# EAGLE design main (EAGLE 9.6.2)

## Sheet 1 of 4
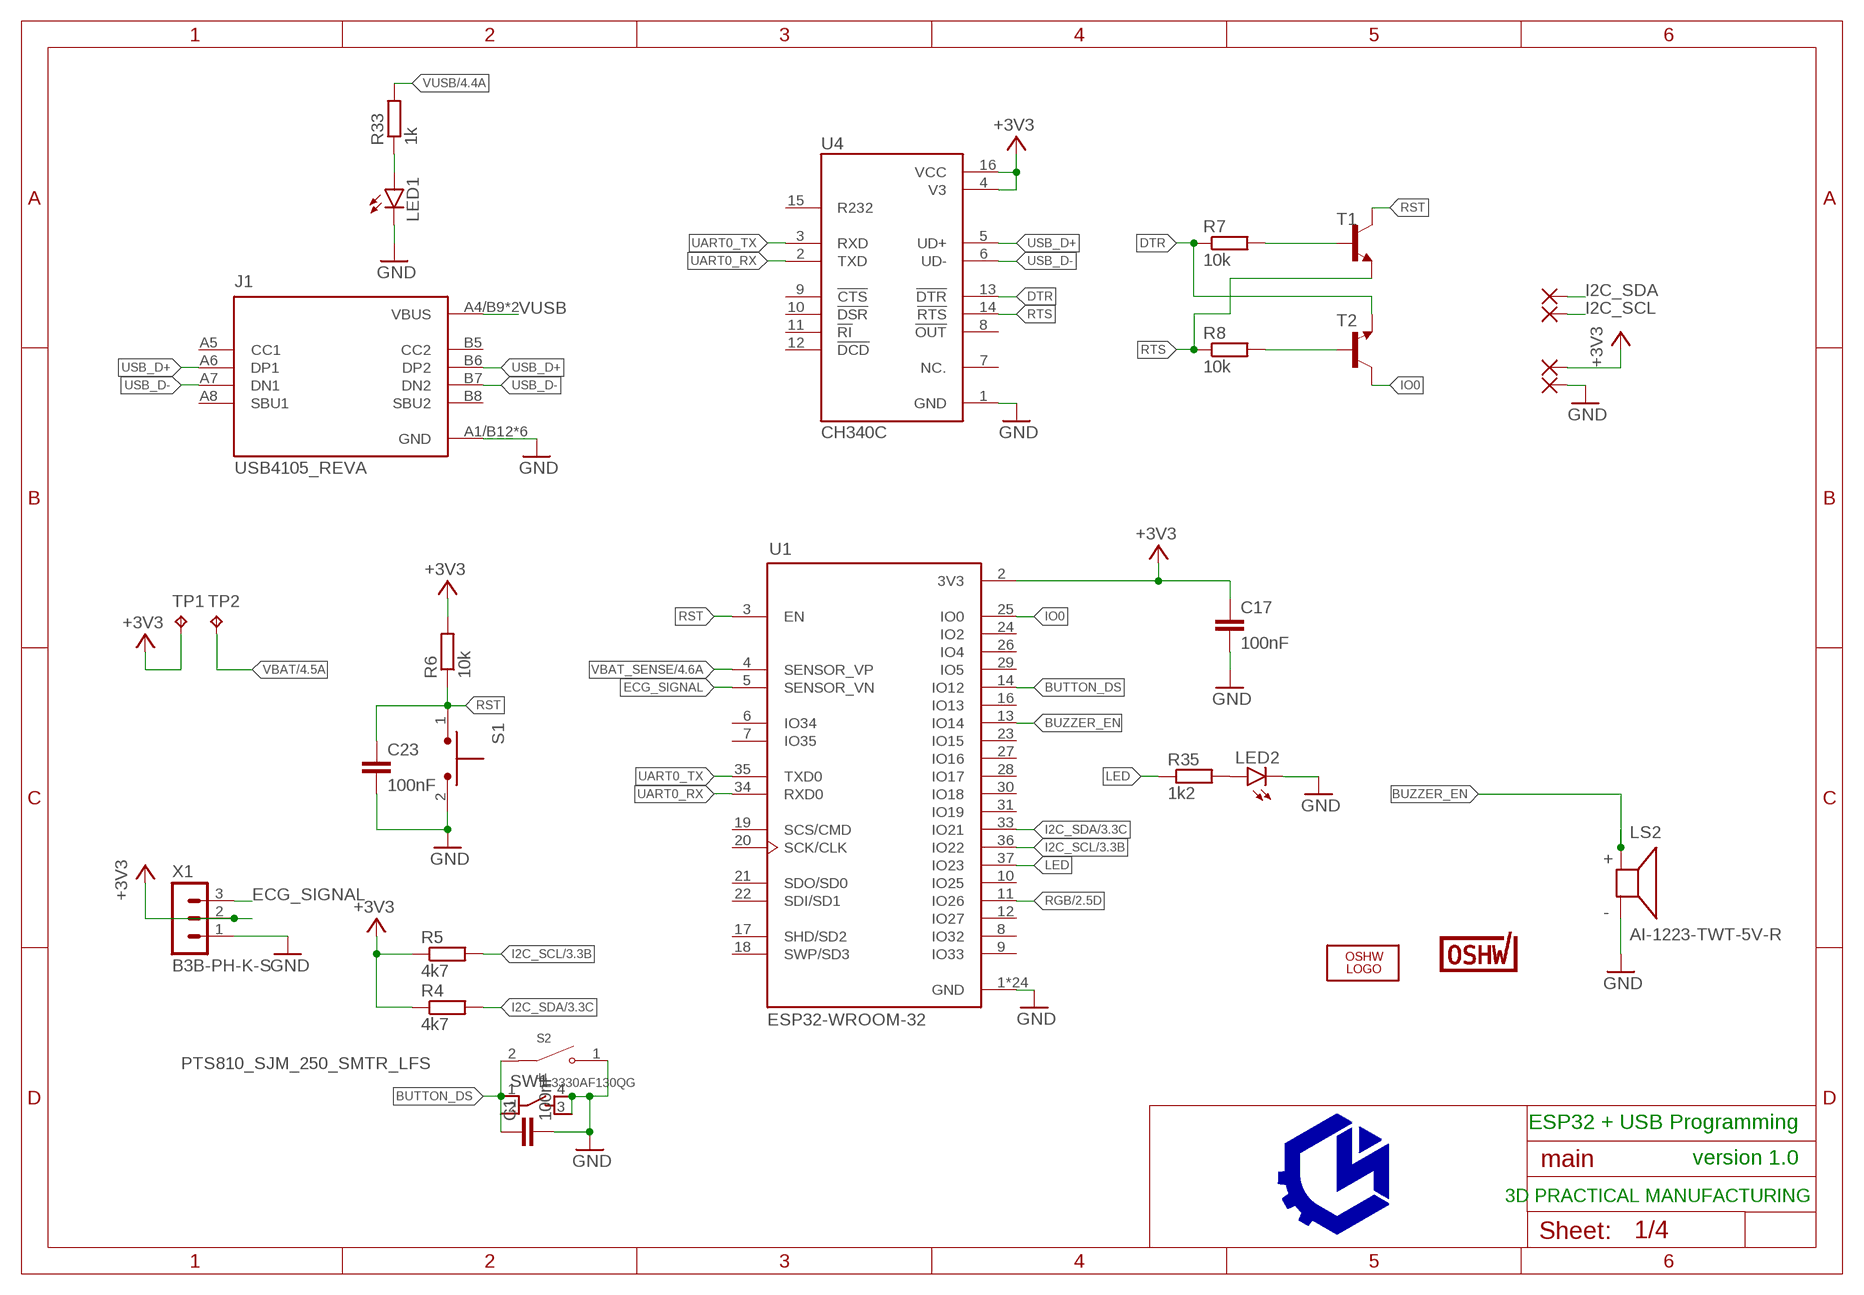
[diagram p0: schematic, sheet 1]

### Parts
C1  100nF  C-EUC0603  [C0603]
C17  100nF  C-EUC0603  [C0603]
C23  100nF  C-EUC0603  [C0603]
J1  USB4105_REVA  [GCT_USB4105_REVA]
LED1  LEDCHIP-LED0603  [CHIP-LED0603]
LED2  LEDCHIP-LED0603  [CHIP-LED0603]
LOGO2  OSHW_LOGO_FILLX0200-NT  [OSHW_FILLX200_NOTEXT]
LS2  AI-1223-TWT-5V-R  [XDCR_AI-1223-TWT-5V-R]
PAD1  WIREPADSMD1,27-254  [SMD1,27-2,54]
PAD2  WIREPADSMD1,27-254  [SMD1,27-2,54]
PAD3  WIREPADSMD1,27-254  [SMD1,27-2,54]
PAD4  WIREPADSMD1,27-254  [SMD1,27-2,54]
R4  4k7  R-EU_R0603  [R0603]
R5  4k7  R-EU_R0603  [R0603]
R6  10k  R-EU_R0603  [R0603]
R7  10k  R-EU_R0603  [R0603]
R8  10k  R-EU_R0603  [R0603]
R33  1k  R-EU_R0603  [R0603]
R35  1k2  R-EU_R0603  [R0603]
S1  TL1015AF160QG  [SW_TL1015AF160QG]
S2  TL3330AF130QG  [SW_TL3330AF130QG]
SW1  PTS810_SJM_250_SMTR_LFS  [SW_PTS810_SJM_250_SMTR_LFS]
T1  MMBT4401LT1-NPN-SOT23-BEC  [SOT23-BEC]
T2  MMBT4401LT1-NPN-SOT23-BEC  [SOT23-BEC]
TP1  TPB1,27  [B1,27]
TP2  TPB1,27  [B1,27]
U1  ESP32-WROOM-32  [MODULE_ESP32-WROOM-32]
U4  CH340C  [SOIC127P600X180-16N]
U$10  CERT-SMALL  [CERT-SMALL-SILK]
X1  B3B-PH-K-S  [B3B-PH-K-S]

### Nets
+3V3: C17.1 PAD4.1(P) R4.1 R5.1 R6.2 TP1.TP U1.2(3V3) U4.4(V3) U4.16(VCC) X1.2 ; also sheet 2,3,4
BUTTON_DS: C1.1 S2.2 SW1.1 SW1.2 U1.14(IO12)
BUZZER_EN: LS2.P(+) U1.13(IO14)
DTR: R7.1 T2.E U4.13(!DTR)
ECG_SIGNAL: U1.5(SENSOR_VN) X1.3
GND: C1.2 C17.2 C23.2 J1.A1/B12(GND) J1.B1/A12(GND) J1.G1(GND) J1.G2(GND) J1.G3(GND) J1.G4(GND) LED1.C LED2.C LS2.N(-) PAD2.1(P) S1.2 S2.1 SW1.3 SW1.4 U1.1(GND) U1.15(GND) U1.38(GND) U1.39_1(GND) U1.39_2(GND) U1.39_3(GND) U1.39_4(GND) U1.39_5(GND) U1.39_6(GND) U1.39_7(GND) U1.39_8(GND) U1.39_9(GND) U1.39_10(GND) U1.39_11(GND) U1.39_12(GND) U1.39_13(GND) U1.39_14(GND) U1.39_15(GND) U1.39_16(GND) U1.39_17(GND) U1.39_18(GND) U1.39_19(GND) U1.39_20(GND) U1.39_21(GND) U4.1(GND) X1.1 ; also sheet 2,3,4
I2C_SCL: PAD3.1(P) R5.2 U1.36(IO22) ; also sheet 3
I2C_SDA: PAD1.1(P) R4.2 U1.33(IO21) ; also sheet 3
IO0: T2.C U1.25(IO0)
LED: R35.1 U1.37(IO23)
N$1: R7.2 T1.B
N$2: R8.2 T2.B
N$10: LED1.A R33.1
N$22: LED2.A R35.2
RGB: U1.11(IO26) ; also sheet 2
RST: C23.1 R6.1 S1.1 T1.C U1.3(EN)
RTS: R8.1 T1.E U4.14(!RTS)
UART0_RX: U1.34(RXD0) U4.2(TXD)
UART0_TX: U1.35(TXD0) U4.3(RXD)
USB_D+: J1.A6(DP1) J1.B6(DP2) U4.5(UD+)
USB_D-: J1.A7(DN1) J1.B7(DN2) U4.6(UD-)
VBAT: TP2.TP ; also sheet 4
VBAT_SENSE: U1.4(SENSOR_VP) ; also sheet 4
VUSB: J1.A4/B9(VBUS) J1.B4/A9(VBUS) R33.2 ; also sheet 4
Unconnected: J1.A5(CC1) J1.A8(SBU1) J1.B5(CC2) J1.B8(SBU2) U1.6(IO34) U1.7(IO35) U1.8(IO32) U1.9(IO33) U1.10(IO25) U1.12(IO27) U1.16(IO13) U1.17(SHD/SD2) U1.18(SWP/SD3) U1.19(SCS/CMD) U1.20(SCK/CLK) U1.21(SDO/SD0) U1.22(SDI/SD1) U1.23(IO15) U1.24(IO2) U1.26(IO4) U1.27(IO16) U1.28(IO17) U1.29(IO5) U1.30(IO18) U1.31(IO19) U4.7(NC.) U4.8(!OUT) U4.9(!CTS) U4.10(!DSR) U4.11(!RI) U4.12(!DCD) U4.15(R232)

### Notes on the sheet
- ESP32 + USB Programming
- version 1.0
- 3D PRACTICAL MANUFACTURING

## Sheet 2 of 4
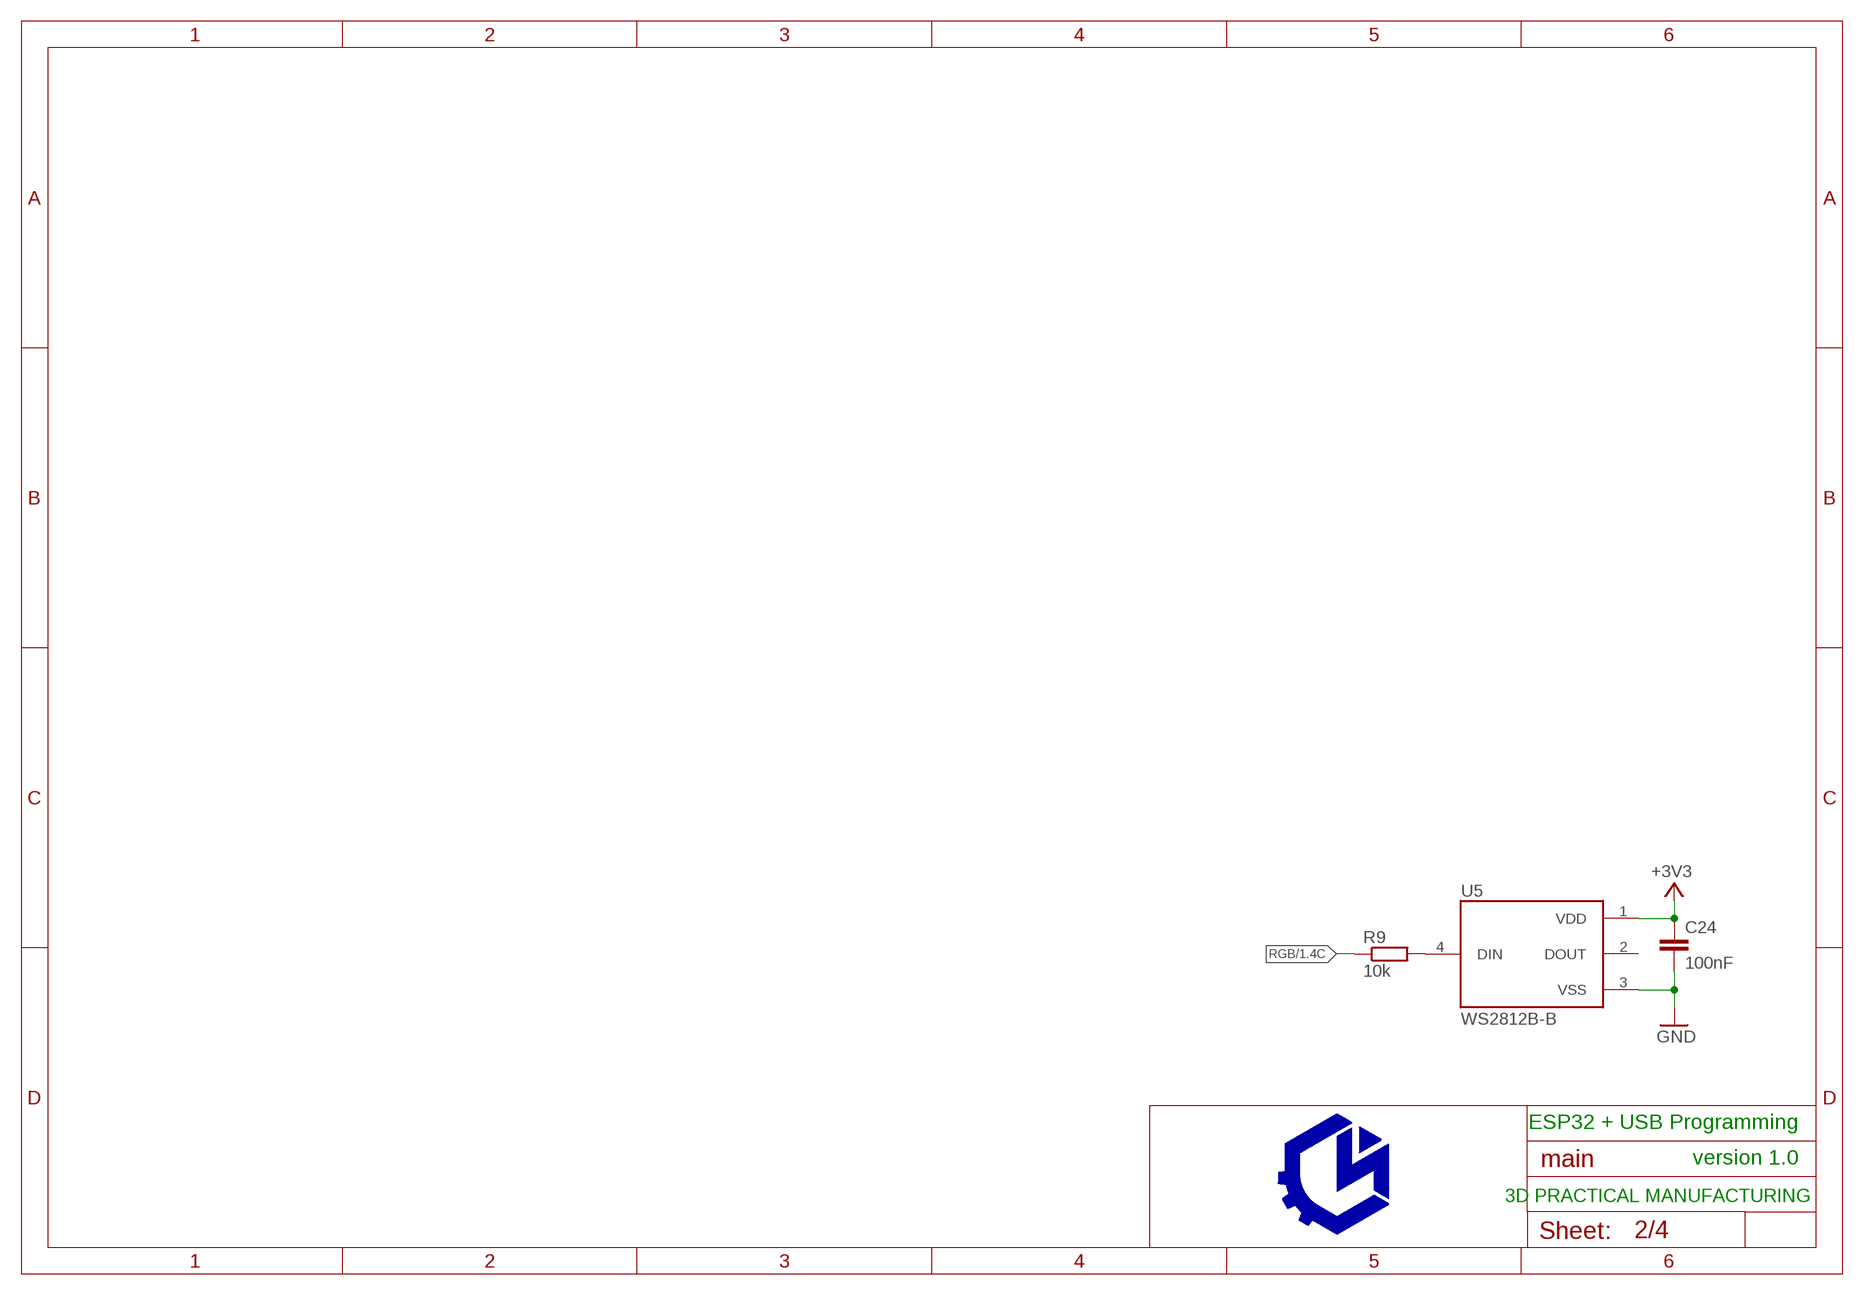
[diagram p1: schematic, sheet 2]

### Parts
C24  100nF  C-EUC0603  [C0603]
R9  10k  R-EU_R0603  [R0603]
U5  WS2812B-B  [LED_WS2812B-B]

### Nets
+3V3: C24.1 U5.1(VDD) ; also sheet 1,3,4
GND: C24.2 U5.3(VSS) ; also sheet 1,3,4
N$3: R9.2 U5.4(DIN)
RGB: R9.1 ; also sheet 1
Unconnected: U5.2(DOUT)

### Notes on the sheet
- ESP32 + USB Programming
- version 1.0
- 3D PRACTICAL MANUFACTURING

## Sheet 3 of 4
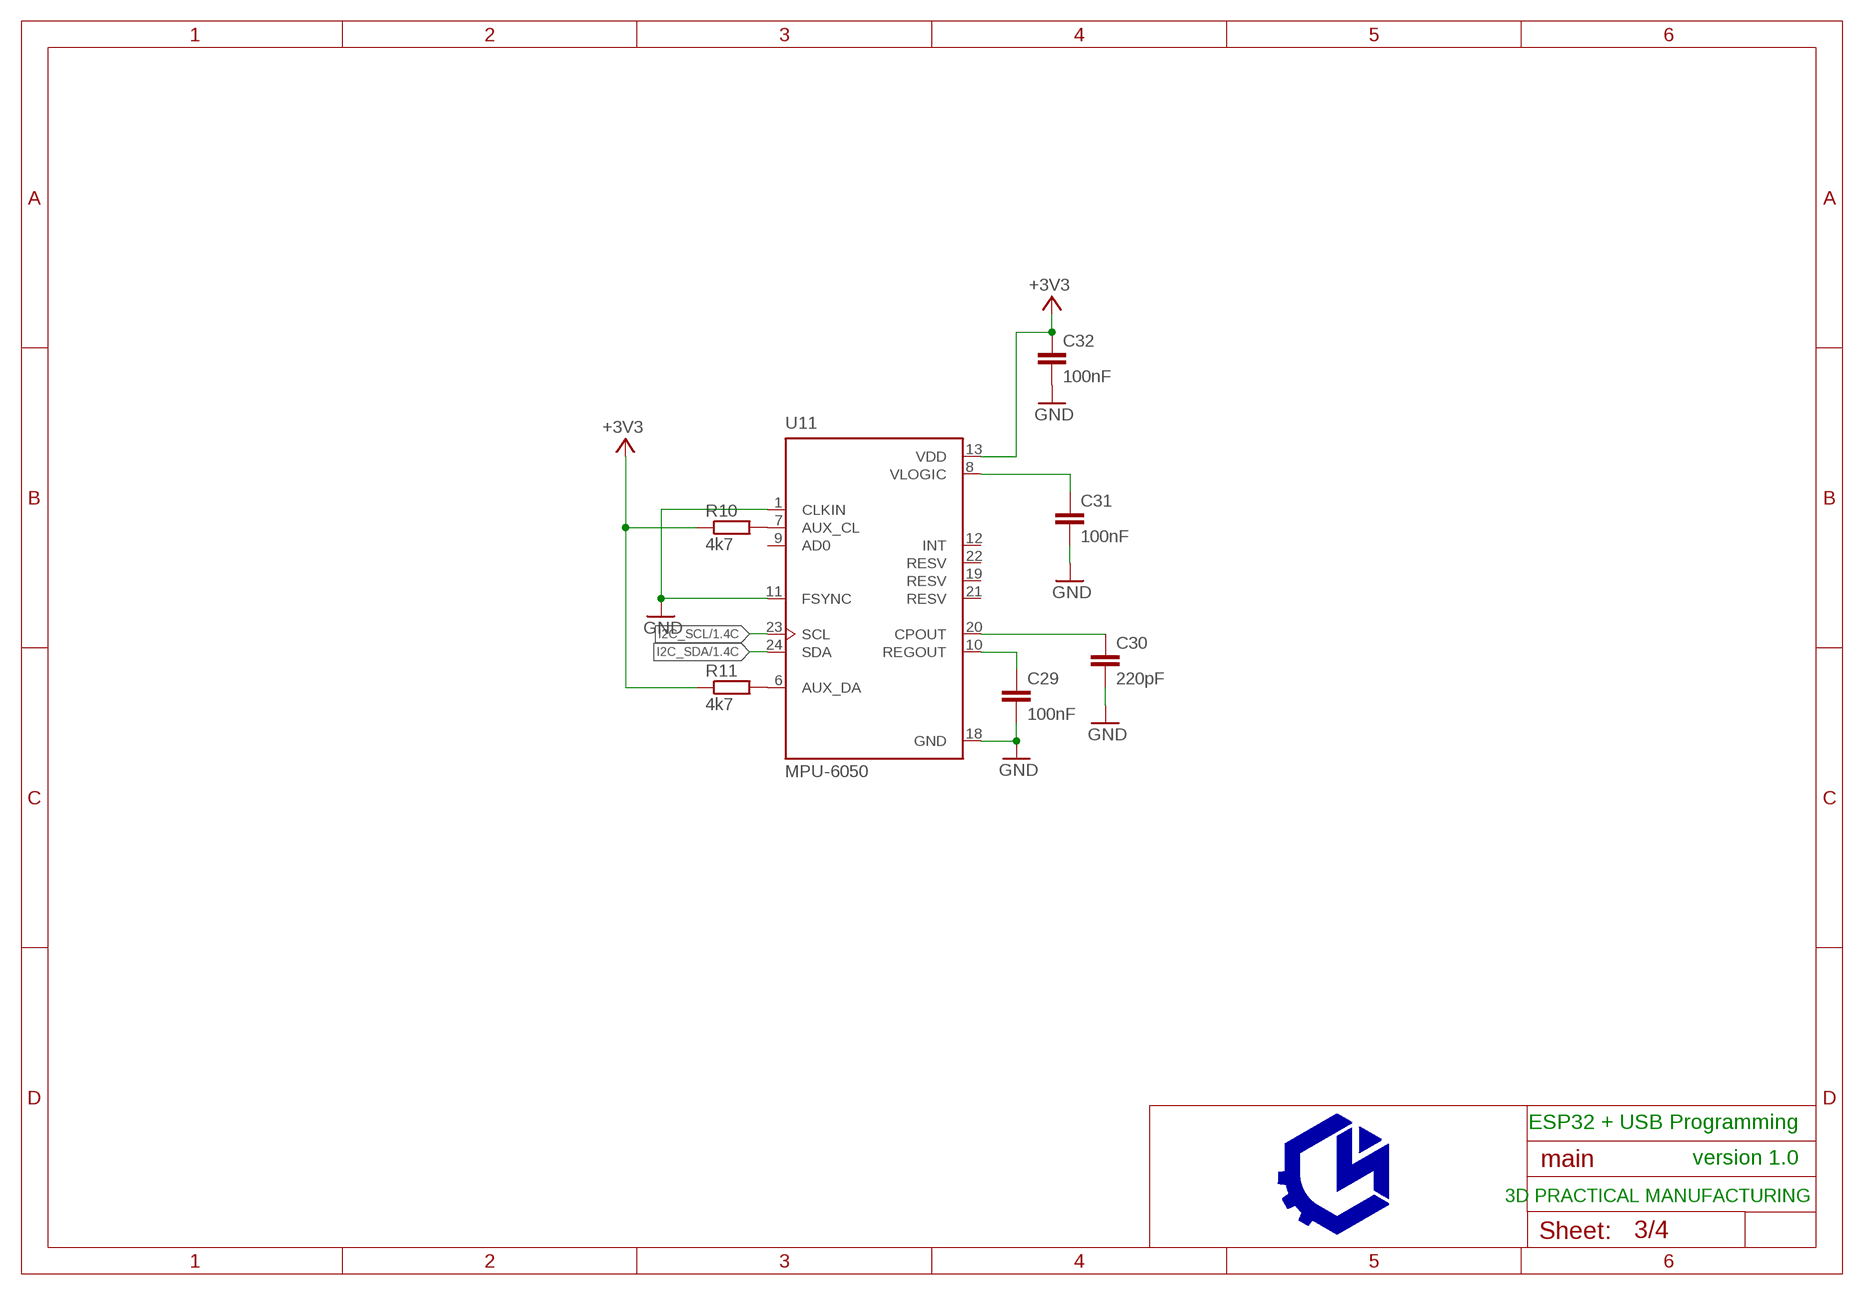
[diagram p2: schematic, sheet 3]

### Parts
C29  100nF  C-EUC0603  [C0603]
C30  220pF  C-EUC0603  [C0603]
C31  100nF  C-EUC0603  [C0603]
C32  100nF  C-EUC0603  [C0603]
R10  4k7  R-EU_R0603  [R0603]
R11  4k7  R-EU_R0603  [R0603]
U11  MPU-6050  [QFN50P400X400X95-24N]

### Nets
+3V3: C32.1 R10.1 R11.1 U11.13(VDD) ; also sheet 1,2,4
GND: C29.2 C30.2 C31.2 C32.2 U11.1(CLKIN) U11.11(FSYNC) U11.18(GND) ; also sheet 1,2,4
I2C_SCL: U11.23(SCL) ; also sheet 1
I2C_SDA: U11.24(SDA) ; also sheet 1
N$8: C29.1 U11.10(REGOUT)
N$24: R10.2 U11.7(AUX_CL)
N$25: R11.2 U11.6(AUX_DA)
N$26: C31.1 U11.8(VLOGIC)
N$27: C30.1 U11.20(CPOUT)
Unconnected: U11.9(AD0) U11.12(INT) U11.19(RESV) U11.21(RESV) U11.22(RESV)

### Notes on the sheet
- ESP32 + USB Programming
- version 1.0
- 3D PRACTICAL MANUFACTURING

## Sheet 4 of 4
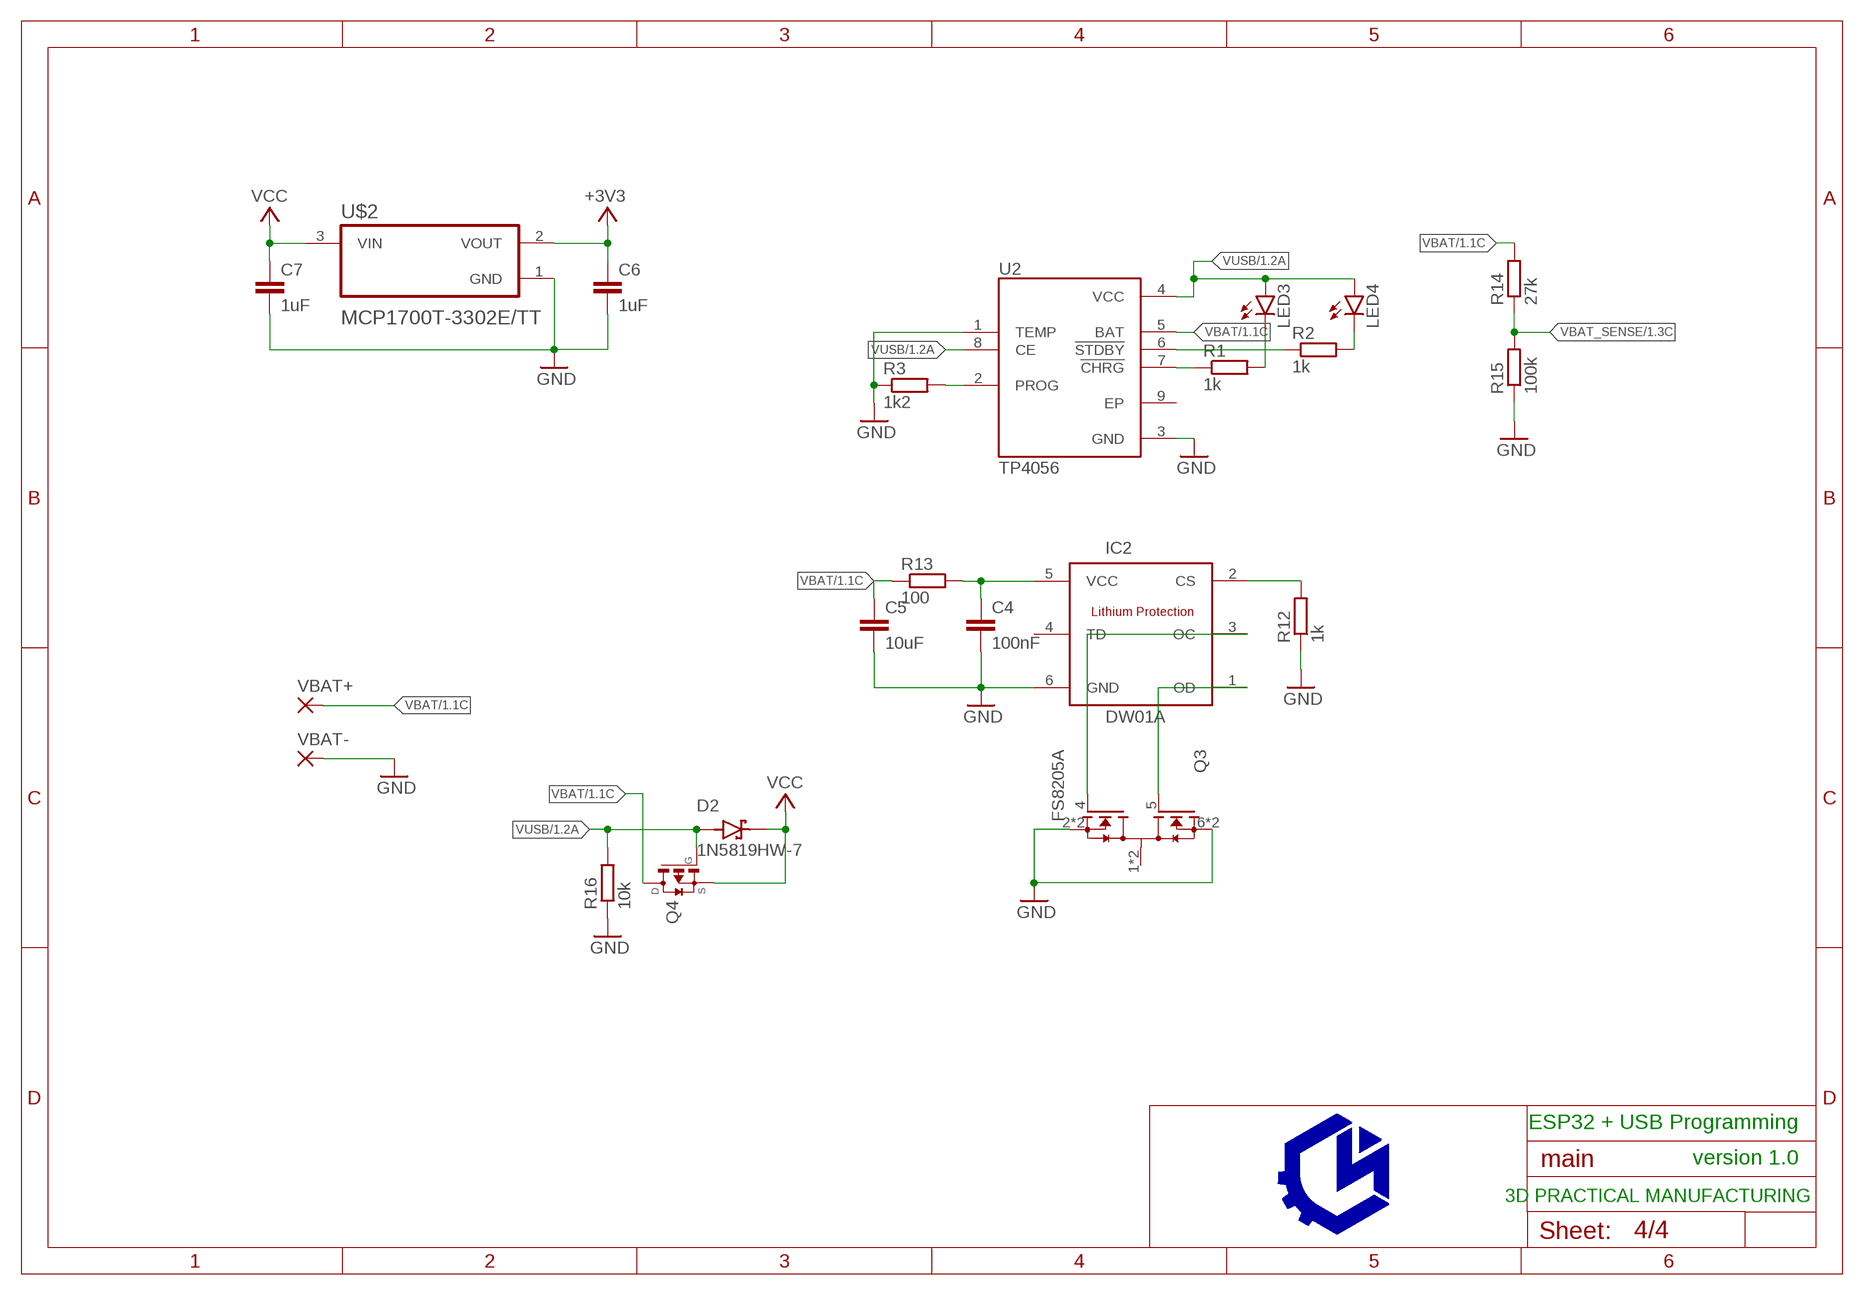
[diagram p3: schematic, sheet 4]

### Parts
C4  100nF  C-EUC0603  [C0603]
C5  10uF  C-EUC0603  [C0603]
C6  1uF  C-EUC0603  [C0603]
C7  1uF  C-EUC0603  [C0603]
D2  1N5819HW-7  [SOD3715X145N]
IC2  DW01A  [SOT23-6]
LED3  LEDCHIP-LED0603  [CHIP-LED0603]
LED4  LEDCHIP-LED0603  [CHIP-LED0603]
Q3  FS8205A  [SOP65P640X120-8N]
Q4  TRANSISTOR-FET_DMP2004K  [TRANSISTOR-FET_SOT23]
R1  1k  R-EU_R0603  [R0603]
R2  1k  R-EU_R0603  [R0603]
R3  1k2  R-EU_R0603  [R0603]
R12  1k  R-EU_R0603  [R0603]
R13  100  R-EU_R0603  [R0603]
R14  27k  R-EU_R0603  [R0603]
R15  100k  R-EU_R0603  [R0603]
R16  10k  R-EU_R0603  [R0603]
U2  TP4056  [SOP127P600X175-9N]
U$2  MCP1700T-3302E/TT  [SOT95P237X112-3N]
VBAT+  WIREPADSMD1,27-254  [SMD1,27-2,54]
VBAT-  WIREPADSMD1,27-254  [SMD1,27-2,54]

### Nets
+3V3: C6.1 U$2.2(VOUT) ; also sheet 1,2,3
GND: C4.2 C5.2 C6.2 C7.2 IC2.6(GND) Q3.2(S1) Q3.3(S1) Q3.6(S2) Q3.7(S2) R3.1 R12.1 R15.1 R16.1 U2.1(TEMP) U2.3(GND) U$2.1(GND) VBAT-.1(P) ; also sheet 1,2,3
N$4: R2.1 U2.6(!STDBY)
N$6: LED3.C R1.2
N$7: LED4.C R2.2
N$9: R1.1 U2.7(!CHRG)
N$17: R3.2 U2.2(PROG)
N$21: IC2.1(OD) Q3.5(G2)
N$23: IC2.3(OC) Q3.4(G1)
N$28: IC2.2(CS) R12.2
N$29: C4.1 IC2.5(VCC) R13.2
VBAT: C5.1 Q4.3(D) R13.1 R14.2 U2.5(BAT) VBAT+.1(P) ; also sheet 1
VBAT_SENSE: R14.1 R15.2 ; also sheet 1
VCC: C7.1 D2.C(K) Q4.2(S) U$2.3(VIN)
VUSB: D2.A LED3.A LED4.A Q4.1(G) R16.2 U2.4(VCC) U2.8(CE) ; also sheet 1
Unconnected: IC2.4(TD) Q3.1(D12) Q3.8(D12) U2.9(EP)

### Notes on the sheet
- ESP32 + USB Programming
- version 1.0
- 3D PRACTICAL MANUFACTURING

## Library data of the parts
C1 C4-C7 C17 C23 C24 C29-C32 = rcl:C-EU: CAPACITOR, European symbol; SPICEPREFIX: C
D2 = 1N5819HW-7:1N5819HW-7: 1N5819HW Series 40 V 1 A Surface Mount Schottky Barrier Rectifier - SOD-123 Check availability <https://pricing.snapeda.com/parts/1N5819HW-7/Diodes%20Inc./view-part?ref=eda>; AVAILABILITY: In Stock; DESCRIPTION: Diode Schottky 40 V 1A Surface Mount SOD-123; MF: Diodes Inc.; MP: 1N5819HW-7; PACKAGE: SOD-123 Fairchild Semiconductor; PRICE: None; PURCHASE-URL: https://pricing.snapeda.com/search/part/1N5819HW-7/?ref=eda
IC2 = DW01A:DW01A: Check availability <https://pricing.snapeda.com/parts/DW01A/Fortune%20Semiconductor/view-part?ref=eda>; AVAILABILITY: Not in stock; DESCRIPTION: One Cell Lithium-ion/Polymer Battery Protection IC; MF: Fortune Semiconductor; MP: DW01A; PACKAGE: SOT-23-6 Fortune Semiconductor; PRICE: None
J1 = USB4105_REVA:USB4105_REVA: USB Type C Receptacle for USB 2.0 SMT Type, PCB Top Mount; AVAILABILITY: Unavailable; DESCRIPTION: USB-C (USB TYPE-C) USB 2.0 Receptacle Connector 24 (16+8 Dummy) Position Surface Mount, Right Angle; Through Hole; MF: Global Connector Technology; MP: USB4105; PACKAGE: Package; PRICE: None
LED1-LED4 = led:LED: LED OSRAM: - CHIPLED LG R971, LG N971, LY N971, LG Q971, LY Q971, LO R971, LY R971 LH N974, LH R974 LS Q976, LO Q976, LY Q976 LO Q996 - Hyper CHIPLED LW Q18S LB Q993, LB Q99A, LB R99A - SideLED LS A670, LO A670, LY A670, LG A670, LP A670 LB A673, LV A673, LT A673, LW A673 LH A674 LY A675 LS A676, LA A676, LO A676, LY A676, LW A676 LS A679, LY A679, LG A679 - Hyper Micro SIDELED® LS Y876, LA Y876, LO Y876, LY Y876 LT Y87S - SmartLED LW L88C, LW L88S LB L89C, LB L89S, LG L890 LS L89K, LO L89K, LY L89K LS L896, LA L896, LO L896, LY L896 - TOPLED LS T670, LO T670, LY T670, LG T670, LP T670 LSG T670, LSP T670, LSY T670, LOP T670, LYG T670 LG T671, LOG T671, LSG T671 LB T673, LV T673, LT T673, LW T673 LH T674 LS T676, LA T676, LO T676, LY T676, LB T676, LH T676, LSB T676, LW T676 LB T67C, LV T67C, LT T67C, LS T67K, LO T67K, LY T67K, LW E67C LS E67B, LA E67B, LO E67B, LY E67B, LB E67C, LV E67C, LT E67C LW T67C LS T679, LY T679, LG T679 LS T770, LO T770, LY T770, LG T770, LP T770 LB T773, LV T773, LT T773, LW T773 LH T774 LS E675, LA E675, LY E675, LS T675 LS T776, LA T776, LO T776, LY T776, LB T776 LHGB T686 LT T68C, LB T68C - Hyper Mini TOPLED® LB M676 - Mini TOPLED Santana® LG M470 LS M47K, LO M47K, LY M47K Source: http://www.osram.convergy.de LUXEON: - LUMILED® LXK2-PW12-R00, LXK2-PW12-S00, LXK2-PW14-U00, LXK2-PW14-V00 LXK2-PM12-R00, LXK2-PM12-S00, LXK2-PM14-U00 LXK2-PE12-Q00, LXK2-PE12-R00, LXK2-PE12-S00, LXK2-PE14-T00, LXK2-PE14-U00 LXK2-PB12-K00, LXK2-PB12-L00, LXK2-PB12-M00, LXK2-PB14-N00, LXK2-PB14-P00, LXK2-PB14-Q00 LXK2-PR12-L00, LXK2-PR12-M00, LXK2-PR14-Q00, LXK2-PR14-R00 LXK2-PD12-Q00, LXK2-PD12-R00, LXK2-PD12-S00 LXK2-PH12-R00, LXK2-PH12-S00 LXK2-PL12-P00, LXK2-PL12-Q00, LXK2-PL12-R00 Source: www.luxeon.com KINGBRIGHT: KA-3528ASYC Source: www.kingbright.com
LOGO2 = ohw-logo:OSHW_LOGO_FILL
LS2 = AI-1223-TWT-5V-R:AI-1223-TWT-5V-R: Check availability <https://pricing.snapeda.com/parts/AI-1223-TWT-5V-R/PUI%20Audio%2C/view-part?ref=eda>; AVAILABILITY: In Stock; DESCRIPTION: ELECTRO MECHANICAL AUDIO INDICATOR; MF: PUI Audio,; MP: AI-1223-TWT-5V-R; PACKAGE: 2225 PUI Audio; PRICE: None; PURCHASE-URL: https://pricing.snapeda.com/search/part/AI-1223-TWT-5V-R/?ref=eda
PAD1-PAD4 VBAT+ VBAT- = wirepad:WIREPAD: Wire PAD connect wire on PCB
Q3 = FS8205A:FS8205A: N/A Check availability <https://pricing.snapeda.com/parts/FS8205A/Fortune%20Semiconductor/view-part?ref=eda>; AVAILABILITY: Not in stock; MF: Fortune Semiconductor; MP: FS8205A; PACKAGE: Package; PRICE: None
Q4 = 52101-101-REV-A_v16:TRANSISTOR-FET_DMP2004K: P-Channel Enhancement MOSFET
R1-R16 R33 R35 = rcl:R-EU_: RESISTOR, European symbol; SPICEPREFIX: R
S1 = TL1015AF160QG:TL1015AF160QG: Tactile Switch SPST-NO Top Actuated Surface Mount Check prices <https://pricing.snapeda.com/parts/TL1015AF160QG/E-Switch/view-part?ref=eda>; AVAILABILITY: In Stock; DESCRIPTION: Tactile Switch SPST-NO Top Actuated Surface Mount; MF: E-Switch; MP: TL1015AF160QG; PACKAGE: SOIC-14 E-Switch; PRICE: None; PURCHASE-URL: https://pricing.snapeda.com/search/part/TL1015AF160QG/?ref=eda
S2 = TL3330AF130QG:TL3330AF130QG: Check availability <https://pricing.snapeda.com/parts/TL3330AF130QG/E-Switch/view-part?ref=eda>; AVAILABILITY: In Stock; DESCRIPTION: Tactile Switch SPST-NO Side Actuated Surface Mount, Right Angle; MF: E-Switch; MP: TL3330AF130QG; PACKAGE: None; PRICE: None; PURCHASE-URL: https://pricing.snapeda.com/search/part/TL3330AF130QG/?ref=eda
SW1 = PTS810_SJM_250_SMTR_LFS:PTS810_SJM_250_SMTR_LFS: Switch Tactile Spst-No 0.05a 16v Check prices <https://pricing.snapeda.com/parts/PTS810%20SJM%20250%20SMTR%20LFS/C%26K/view-part?ref=eda>; AVAILABILITY: In Stock; DESCRIPTION: Tactile Switch SPST-NO Top Actuated Surface Mount; MF: C&K; MP: PTS810 SJM 250 SMTR LFS; PACKAGE: None; PRICE: None; PURCHASE-URL: https://pricing.snapeda.com/search/part/PTS810 SJM 250 SMTR LFS/?ref=eda
T1 T2 = DC_LOAD_AU:*-NPN-: NPN Transistror BF959 corrected 2008.03.06
TP1 TP2 = testpad:TP: Test pad
U1 = ESP32-WROOM-32:ESP32-WROOM-32: Bluetooth, WiFi Transceiver Module 2.4GHz ~ 2.5GHz Surface Mount; AVAILABILITY: Unavailable; DESCRIPTION: Bluetooth, WiFi 802.11b/g/n, Bluetooth v4.2 +EDR, Class 1, 2 and 3 Transceiver Module 2.4GHz ~ 2.5GHz Antenna Not Included, U.FL Surface Mount; MF: Espressif Systems; MP: ESP32-WROOM-32; PACKAGE: Module Espressif Systems; PRICE: None
U2 = TP4056:TP4056: Complete single cell Li-Ion battery with a constant current / constant voltage linear charger Check availability <https://pricing.snapeda.com/parts/TP4056/NanJing%20Top%20Power%20ASIC%20Corp./view-part?ref=eda>; AVAILABILITY: Not in stock; DESCRIPTION: Complete single cell Li-Ion battery with a constant current / constant voltage linear charger; MF: NanJing Top Power ASIC Corp.; MP: TP4056; PACKAGE: None; PRICE: None
U4 = CH340C:CH340C: USB to serial chip CH340 Check availability <https://pricing.snapeda.com/parts/CH340C/WCH/view-part?ref=eda>; AVAILABILITY: Not in stock; DESCRIPTION: USB to serial chip CH340; MF: WCH; MP: CH340C; PACKAGE: None; PRICE: None
U5 = WS2812B-B:WS2812B-B: Intelligent control LED integrated light source Check availability <https://pricing.snapeda.com/parts/WS2812B-B/Worldsemi/view-part?ref=eda>; AVAILABILITY: Not in stock; DESCRIPTION: Intelligent control LED integrated light source; MF: Worldsemi; MP: WS2812B-B; PACKAGE: Package; PRICE: None
U11 = MPU-6050:MPU-6050: MPU-6050 Six-Axis (Gyro + Accelerometer) MEMS MotionTracking™ Devices Check availability <https://pricing.snapeda.com/parts/MPU-6050/TDK%20InvenSense/view-part?ref=eda>; AVAILABILITY: In Stock; DESCRIPTION: MPU-6050 series Accelerometer, Gyroscope, 3 Axis Sensor Evaluation Board; MF: TDK InvenSense; MP: MPU-6050; PACKAGE: QFN-24 InvenSense; PRICE: None; PURCHASE-URL: https://pricing.snapeda.com/search/part/MPU-6050/?ref=eda
U$2 = MCP1700T-3302E_TT:MCP1700T-3302E/TT: Check availability <https://pricing.snapeda.com/parts/MCP1700T-3302E/TT/Microchip/view-part?ref=eda>; AVAILABILITY: In Stock; DESCRIPTION: Linear Voltage Regulator IC Positive Fixed 1 Output 250mA SOT-23-3; MF: Microchip; MP: MCP1700T-3302E/TT; PACKAGE: SOT-23 Microchip; PRICE: None; PURCHASE-URL: https://pricing.snapeda.com/search/part/MCP1700T-3302E/TT/?ref=eda
U$10 = OSHWA:CERT
X1 = con-JST PH:B3B-PH: JST PH series header 2.00mm pitch disconnectable crimp style connectors, vertical (side entry type), 3 pins

## Board
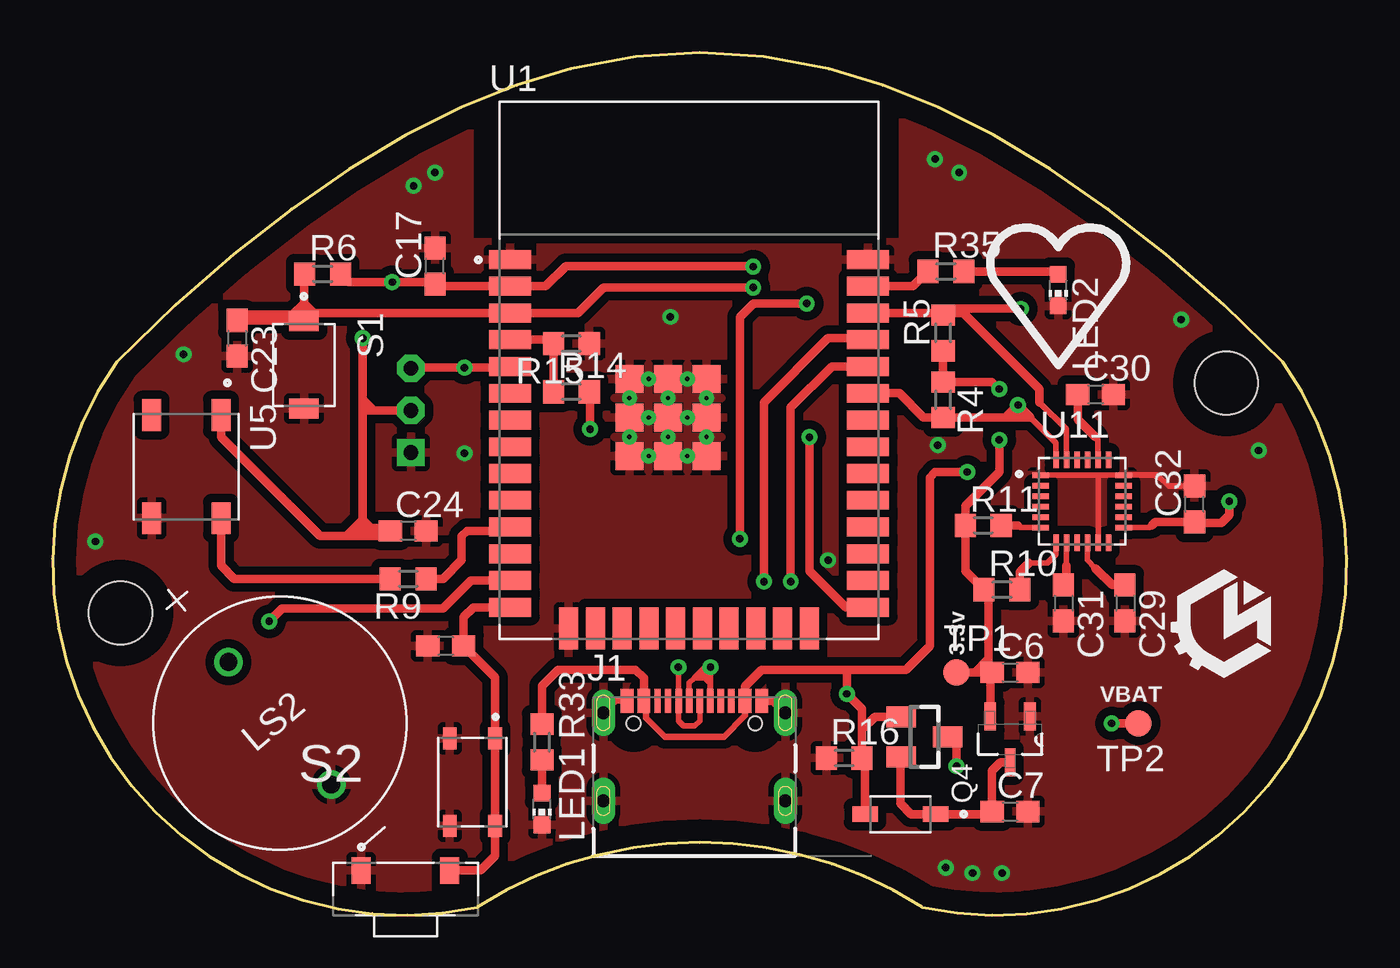
[diagram p4: board, top side]
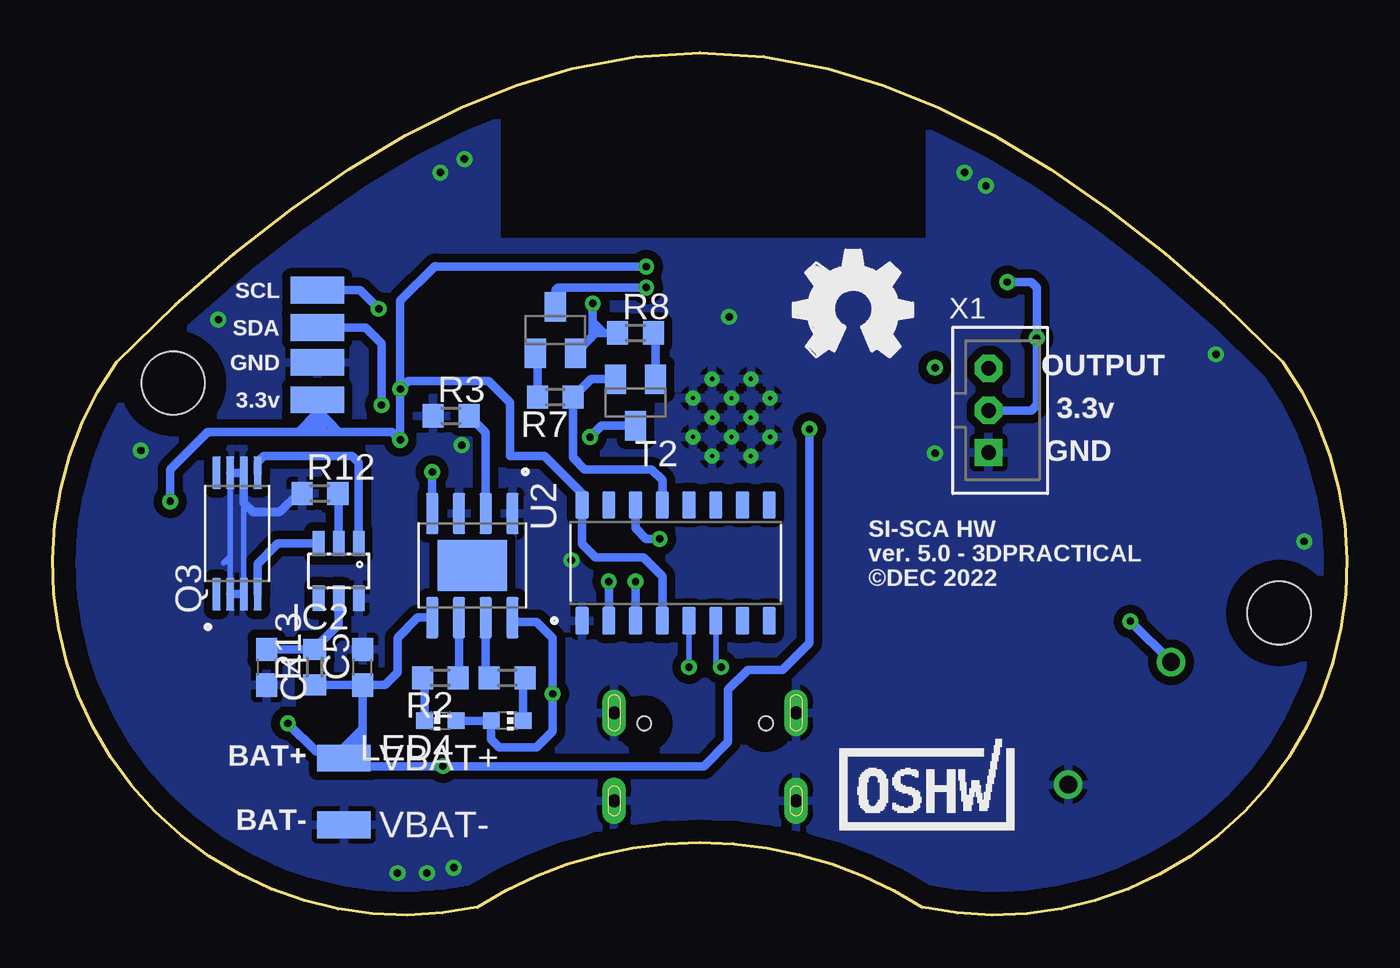
[diagram p5: board, bottom side, seen from below]

Size 61.45 x 40.96 mm. Coordinates in mm from the lower left corner, seen from the top.
Outline: 24.61,40.19 22.03,39.41 19.41,38.36 16.76,37.03 14.07,35.42 11.35,33.53 8.6,31.38 5.83,28.96 3.03,26.27 arc137 20.15,0.37 arc-32 30.73,3.45 arc-32 41.3,0.37 arc137 58.42,26.27 55.63,28.96 52.86,31.38 50.11,33.53 47.39,35.42 44.7,37.03 42.04,38.36 39.43,39.41 36.84,40.19 33.78,40.76 30.73,40.96 27.68,40.76 24.61,40.19
Copper layers (1*16): Top 0.035mm / dielectric 1.5mm / Bottom 0.035mm
Design rules "default": minimum track width 6mil, minimum drill 0.35mm, track to track 6mil, track to pad 6mil, pad to pad 6mil, via to via 6mil, smd to smd 6mil, copper to edge 40mil, drill to drill 6mil, minimum pad ring 10mil, minimum via ring 8mil, stop-mask expansion 4mil, vias tented up to drill 0mil, thermal gap 10mil
Holes 3 mm at 3.21,14.35 55.73,25.26

### Footprints (pad centres in the part's own frame; a part is rotated, then mirrored left to right if it is on the bottom)
C0603 = smd 1.1 x 1: 1 -0.85,0; 2 0.85,0
SOD3715X145N = smd 1.21 x 0.73: A 1.68,0; C -1.68,0
SOT23-6 = smd 0.55 x 1.2: 1 -0.95,-1.3; 2 0,-1.3; 3 0.95,-1.3; 4 0.95,1.3; 5 0,1.3; 6 -0.95,1.3
GCT_USB4105_REVA = smd 0.6 x 1.15: A1/B12 -3.2,4.755; A4/B9 -2.4,4.755; B1/A12 3.2,4.755; B4/A9 2.4,4.755 | smd 0.3 x 1.15: A5 -1.25,4.755; A6 -0.25,4.755; A7 0.25,4.755; A8 1.25,4.755; B5 1.75,4.755; B6 0.75,4.755; B7 -0.75,4.755; B8 -1.75,4.755 | drill 0.6 pad 1 long: G1 -4.32,0; G2 4.32,0 | drill 0.6 pad 1.05 long: G3 -4.32,4.18; G4 4.32,4.18 | hole 0.65: 2.89,3.68; -2.89,3.68
CHIP-LED0603 = smd 0.8 x 0.8: A 0,-0.75; C 0,0.75
XDCR_AI-1223-TWT-5V-R = drill 0.85: N 0,-3.8; P 0,3.8
SMD1,27-2,54 = smd 1.27 x 2.54: 1 0,0
SOP65P640X120-8N = smd 1.56 x 0.4: 1 -2.88,0.975; 2 -2.88,0.325; 3 -2.88,-0.325; 4 -2.88,-0.975; 5 2.88,-0.975; 6 2.88,-0.325; 7 2.88,0.325; 8 2.88,0.975
TRANSISTOR-FET_SOT23 = smd 1 x 1.4: 1 -0.95,-1.1; 2 0.95,-1.1; 3 0,1.1
R0603 = smd 1 x 1.1: 1 -0.85,0; 2 0.85,0
SW_TL1015AF160QG = smd 0.95 x 1.4: 1 -2.075,0; 2 2.075,0
SW_TL3330AF130QG = smd 0.9 x 1.27: 1 -2.1,0.885; 2 2.1,0.885
SW_PTS810_SJM_250_SMTR_LFS = smd 1.05 x 0.65: 1 -2.075,1.075; 2 2.075,1.075; 3 -2.075,-1.075; 4 2.075,-1.075
SOT23-BEC = smd 1 x 1.4: B -0.95,-1.1; C 0,1.1; E 0.95,-1.1
B1,27 = smd 1.27 x 1.27: TP 0,0
MODULE_ESP32-WROOM-32 = smd 2 x 0.9: 1 -8.5,5.26; 2 -8.5,3.99; 3 -8.5,2.72; 4 -8.5,1.45; 5 -8.5,0.18; 6 -8.5,-1.09; 7 -8.5,-2.36; 8 -8.5,-3.63; 9 -8.5,-4.9; 10 -8.5,-6.17; 11 -8.5,-7.44; 12 -8.5,-8.71; 13 -8.5,-9.98; 14 -8.5,-11.25; 25 8.5,-11.25; 26 8.5,-9.98; 27 8.5,-8.71; 28 8.5,-7.44; 29 8.5,-6.17; 30 8.5,-4.9; 31 8.5,-3.63; 32 8.5,-2.36; 33 8.5,-1.09; 34 8.5,0.18; 35 8.5,1.45; 36 8.5,2.72; 37 8.5,3.99; 38 8.5,5.26 | smd 0.9 x 2: 15 -5.715,-12.25; 16 -4.445,-12.25; 17 -3.175,-12.25; 18 -1.905,-12.25; 19 -0.635,-12.25; 20 0.635,-12.25; 21 1.905,-12.25; 22 3.175,-12.25; 23 4.445,-12.25; 24 5.715,-12.25 | smd 1.33 x 1.33: 39_1 -2.835,-0.405; 39_2 -1,-0.405; 39_3 0.835,-0.405; 39_4 -2.835,-2.24; 39_5 -1,-2.24; 39_6 0.835,-2.24; 39_7 -2.835,-4.075; 39_8 -1,-4.075; 39_9 0.835,-4.075 | drill 0.2 pad 0.3: 39_10 -1.917,-0.405; 39_11 -0.083,-0.405; 39_12 -2.835,-1.323; 39_13 -1,-1.323; 39_14 0.835,-1.323; 39_15 -1.917,-2.24; 39_16 -0.083,-2.24; 39_17 -2.835,-3.158; 39_18 -1,-3.158; 39_19 0.835,-3.158; 39_20 -1.917,-4.075; 39_21 -0.083,-4.075
SOP127P600X175-9N = smd 1.97 x 0.6: 1 -2.475,1.905; 2 -2.475,0.635; 3 -2.475,-0.635; 4 -2.475,-1.905; 5 2.475,-1.905; 6 2.475,-0.635; 7 2.475,0.635; 8 2.475,1.905 | smd 2.413 x 3.302: 9 0,0
SOIC127P600X180-16N = smd 1.31 x 0.62: 1 -2.75,4.445; 2 -2.75,3.175; 3 -2.75,1.905; 4 -2.75,0.635; 5 -2.75,-0.635; 6 -2.75,-1.905; 7 -2.75,-3.175; 8 -2.75,-4.445; 9 2.75,-4.445; 10 2.75,-3.175; 11 2.75,-1.905; 12 2.75,-0.635; 13 2.75,0.635; 14 2.75,1.905; 15 2.75,3.175; 16 2.75,4.445
LED_WS2812B-B = smd 1.5 x 0.9: 1 -2.45,1.65; 2 -2.45,-1.65; 3 2.45,-1.65; 4 2.45,1.65
QFN50P400X400X95-24N = smd 0.79 x 0.26: 1 -1.97,1.25; 2 -1.97,0.75; 3 -1.97,0.25; 4 -1.97,-0.25; 5 -1.97,-0.75; 6 -1.97,-1.25; 13 1.97,-1.25; 14 1.97,-0.75; 15 1.97,-0.25; 16 1.97,0.25; 17 1.97,0.75; 18 1.97,1.25 | smd 0.26 x 0.79: 7 -1.25,-1.97; 8 -0.75,-1.97; 9 -0.25,-1.97; 10 0.25,-1.97; 11 0.75,-1.97; 12 1.25,-1.97; 19 1.25,1.97; 20 0.75,1.97; 21 0.25,1.97; 22 -0.25,1.97; 23 -0.75,1.97; 24 -1.25,1.97
SOT95P237X112-3N = smd 1.321 x 0.559: 1 -1.092,0.94; 2 -1.092,-0.94 | smd 1.321 x 0.508: 3 1.092,0
B3B-PH-K-S = drill 0.7 pad 1.3 square: 1 2,0 | drill 0.7 pad 1.3 octagon: 2 0,0; 3 -2,0

### Placement (x,y rotation side)
C1  18.66,12.79 180 top
C4  51.3,11.77 270 bottom
C5  46.73,11.77 90 bottom
C6  45.46,11.52 0 top
C7  45.46,4.91 0 top
C17  18.15,30.82 90 top
C23  8.76,27.39 270 top
C24  16.88,18.25 0 top
C29  50.92,14.82 270 top
C30  49.52,24.73 0 top
C31  48,14.82 270 top
C32  54.22,19.52 90 top
D2  40.25,4.79 180 top
IC2  47.87,16.34 180 bottom
J1  30.47,5.42 0 top
LED1  23.23,5.04 180 top
LED2  47.75,29.68 180 top
LED3  39.87,9.23 270 bottom
LED4  43.05,9.23 90 bottom
LOGO2  26.28,26.5 0 bottom
LS2  10.79,9.1 40 top
PAD1  48.89,27.9 270 bottom
PAD2  48.89,26.25 270 bottom
PAD3  48.89,29.68 270 bottom
PAD4  48.89,24.47 270 bottom
Q3  52.7,18.12 90 bottom
Q4  41.4,8.47 270 top
R1  39.87,11.26 0 bottom
R2  43.05,11.26 180 bottom
R3  42.54,23.71 0 bottom
R4  42.28,24.47 270 top
R5  42.28,27.65 90 top
R6  12.82,30.44 0 top
R7  37.59,24.6 180 bottom
R8  33.78,27.65 0 bottom
R9  16.88,15.96 180 top
R10  45.08,15.45 0 top
R11  44.19,18.5 0 top
R12  48.76,20.03 0 bottom
R13  49.02,11.77 90 bottom
R14  24.63,24.85 0 top
R15  24.63,27.14 180 top
R16  37.59,7.45 0 top
R33  23.23,8.22 90 top
R35  42.41,30.57 0 top
S1  11.93,26.12 270 top
S2  16.76,1.23 0 top
SW1  19.93,6.31 270 top
T1  37.59,27.77 0 bottom
T2  33.78,24.34 180 bottom
TP1  42.92,11.52 0 top
TP2  51.56,9.1 180 top
U1  30.22,25.87 0 top
U2  41.52,16.6 270 bottom
U4  31.87,16.72 90 bottom
U5  6.34,21.3 270 top
U11  48.89,19.65 0 top
U$2  45.46,8.34 270 top
U$10  19.93,4.02 0 bottom
VBAT+  47.62,7.45 90 bottom
VBAT-  47.62,4.28 270 bottom
X1  17.01,23.96 270 bottom

### Tracks (layer width: path | path; a pad name or v marks a point on that pad's centre or on a via)
+3V3  (via drill 0.35)
  Top 0.254: U11.13 52.08,18.4 52.19,18.5
  Top 0.406: R6.2 14.05,30.06 v16.12,30.06 18.07,30.06 C17.1 18.27,29.86 U1.2 23.41,29.86 24.38,30.82 33.27,30.82 v33.27,30.79 | 52.19,18.5 52.36,18.67 53.97,18.67 | 53.97,18.67 C32.1 | v44.95,22.57 44.95,21.04 43.34,19.43 R11.1 43.34,16.34 R10.1 44.44,15.24 44.44,12.15 | v44.95,24.98 44.61,25.32 R4.1 R5.1 | 13.96,18 14.34,18 | 14.34,18 14.47,18 | 14.47,18 15.49,18 | 15.49,18 15.78,18 C24.1 15.91,18.38 15.11,18.38 | v55.87,19.65 55.87,19.01 55.49,18.63 54.01,18.63 53.97,18.67 | v14.73,27.39 14.73,24.47 | 14.73,24.47 14.73,24.09 | 14.73,24.09 14.73,18.76 | 15.49,18 15.11,18.38 | 15.11,18.38 14.73,18.76 | 15.11,18.38 14.85,18.38 14.47,18 | 14.73,18.76 14.34,18.38 | 14.34,18.38 14.34,18 | 14.34,18.38 13.96,18 | TP1.TP 43.81,11.52 | 43.81,11.52 44.44,11.52 | 44.44,11.52 C6.1 44.52,11.43 U$2.2 | 44.44,12.15 44.44,11.52 | 44.44,12.15 43.81,11.52 | U5.1 7.99,22.69 12.69,18 13.96,18 | 14.73,24.09 14.85,23.96 15.23,23.96 | 15.23,23.96 X1.2 | 15.23,23.96 14.73,24.47
  Bottom 0.406: v16.12,30.06 14.98,30.06 14.73,29.81 v14.73,27.39 14.73,24.22 14.98,23.96 X1.2 | U4.4 32.51,16.09 33.39,16.98 35.68,16.98 36.32,17.61 U4.16 36.32,20.03 38.09,21.8 39.74,21.8 39.74,24.34 40.76,25.36 44.57,25.36 v44.95,24.98 | v44.95,24.98 v44.95,22.57 45.33,22.95 47.87,22.95 | v55.87,19.65 55.87,21.17 54.1,22.95 49.78,22.95 | 47.87,22.95 49.02,22.95 | 49.02,22.95 49.52,22.95 | 49.52,22.95 49.78,22.95 | v44.95,24.98 44.95,29.17 43.3,30.82 43.27,30.79 v33.27,30.79 | 47.87,22.95 48.38,23.46 | 48.38,23.46 48.89,23.96 PAD4.1 | PAD4.1 48.89,23.07 | 48.89,23.07 49.02,22.95 | 48.89,23.07 48.63,23.33 48.51,23.33 48.38,23.46 | PAD4.1 48.89,23.58 49.52,22.95 | PAD4.1 48.89,23.84 49.78,22.95
BUTTON_DS
  Top 0.406: U1.14 19.99,14.62 19.51,14.15 C1.1 21.01,11.29 SW1.1 21.01,4.66 SW1.2 21.01,2.81 20.31,2.12 S2.2
BUZZER_EN  (via drill 0.35)
  Top 0.406: v10.28,13.95 10.9,14.57 18.54,14.57 19.86,15.89 U1.13
  Bottom 0.406: LS2.P v10.28,13.95
DTR
  Bottom 0.406: T2.E 35.89,25.44 R7.1 36.74,21.72 36.19,21.17 33.01,21.17 32.51,20.66 U4.13
ECG_SIGNAL  (via drill 0.35)
  Top 0.406: U1.5 21.67,26 v19.55,26 17.04,26 X1.3
GND  (via drill 0.35)
  Top 0.254: U11.1 49.65,20.9 | 49.65,20.9 U11.18 52.34,20.9 | U11.11 49.65,17.69 49.65,20.9 | 52.34,20.9 52.44,20.79 52.51,20.85 | C32.2 52.99,20.37 52.51,20.85 | 52.34,20.9 52.46,20.9 52.51,20.85 | J1.A1/B12 26.73,10.18 J1.G3
  Top 0.406: J1.B1/A12 34.22,10.18 J1.G4
  Bottom 0.254: Q3.2 53.02,16.92 | 53.02,16.92 53.08,16.98 53.33,16.72 | Q3.7 53.02,16.92 | Q3.3 52.37,20.15
  Bottom 0.406: Q3.3 Q3.2 | Q3.7 Q3.6 52.37,20.15 52.37,19.57 51.94,19.14 50.67,19.14 49.78,20.03 R12.1
  other vias: 6.22,26.63 29.33,28.41 17.14,34.63 18.15,35.27 57.27,22.06 53.59,28.28 36.82,16.85 42.03,22.31 19.55,21.93 45.08,1.99 43.68,1.99 42.41,2.25 43.05,35.27 41.9,35.9 2.03,17.74
  pour Top (isolate 0.406): 20.31,31.96 40.38,31.96 40.38,32.85 40.38,39.08 42.79,39.08 62.1,39.08 62.1,0.6 62.1,-2.71 0.76,-2.71 -1.28,-2.71 -1.28,38.44 -1.28,38.82 19.81,38.82 19.81,31.96
  pour Bottom (isolate 0.406): -1.28,38.95 19.81,38.95 19.81,31.96 40.38,31.96 40.38,33.11 40.38,39.2 62.1,39.2 62.1,-2.71 60.19,-2.71 -1.28,-2.71
I2C_SCL  (via drill 0.35)
  Top 0.254: U11.23 48.13,21.63 48.13,23.07 46.86,24.34
  Top 0.406: 42.19,28.59 R5.2 42.58,28.79 v45.97,28.79 | U1.36 42.19,28.59 | 42.19,28.59 43.25,28.59 46.86,24.98 46.86,24.34
  Bottom 0.406: v45.97,28.79 46.86,29.68 PAD3.1
I2C_SDA  (via drill 0.35)
  Top 0.254: U11.24 47.64,22.42 46.44,23.62
  Top 0.406: 45.24,23.62 R4.2 41.36,23.62 40.2,24.78 U1.33 | 45.24,23.62 45.46,23.62 | 45.46,23.62 45.84,23.62 | 45.84,23.62 46.44,23.62 v45.84,24.22 | 45.84,23.62 v45.84,24.22 | 45.46,23.62 45.46,23.84 | v45.84,24.22 45.46,23.84 | 45.46,23.84 45.24,23.62
  Bottom 0.406: v45.84,24.22 45.84,27.14 46.6,27.9 PAD1.1
IO0  (via drill 0.35)
  Top 0.406: v35.93,22.69 35.93,16.34 37.66,14.62 U1.25
  Bottom 0.406: T2.C 35.38,23.24 v35.93,22.69
LED
  Top 0.406: U1.37 40.85,29.86 R35.1
N$1
  Bottom 0.406: R7.2 38.44,26.57 T1.B
N$2
  Bottom 0.406: T2.B 32.83,27.55 R8.2
N$3
  Top 0.406: R9.2 8.63,15.96 7.99,16.6 U5.4
N$4
  Bottom 0.406: R2.1 42.16,11.3 U2.6
N$6
  Bottom 0.406: LED3.C 39.12,11.16 R1.2
N$7
  Bottom 0.406: LED4.C 43.8,11.16 R2.2
N$8
  Top 0.254: U11.10 49.14,16.85 49.52,16.47
  Top 0.406: 49.52,16.47 50.32,15.67 C29.1
N$9
  Bottom 0.406: R1.1 40.89,11.43 U2.7
N$10
  Top 0.406: R33.1 LED1.A
N$17
  Bottom 0.406: R3.2 40.89,22.91 U2.2
N$21
  Bottom 0.406: Q3.5 51.72,21.51 51.43,21.8 47.24,21.8 46.92,21.49 IC2.1
N$22
  Top 0.406: R35.2 47.61,30.57 LED2.A
N$23
  Bottom 0.406: IC2.3 50.76,17.64 51.72,16.68 Q3.4
N$24
  Top 0.254: U11.7 47.64,17.13 47.24,16.72 46.35,16.72
  Top 0.406: 46.35,16.72 45.93,16.3 R10.2
N$25
  Top 0.254: U11.6 45.95,18.4 45.84,18.5
  Top 0.406: 45.84,18.5 R11.2
N$26
  Top 0.254: U11.8 48.14,16.61 48.13,16.6
  Top 0.406: 48.13,16.6 48.13,15.8 C31.1
N$27
  Top 0.254: U11.20 49.64,22.58 49.52,22.69
  Top 0.406: 49.52,22.69 48.67,23.54 C30.1
N$28
  Bottom 0.406: R12.2 47.87,19.99 IC2.2
N$29
  Bottom 0.406: R13.2 49.05,12.62 | C4.1 49.4,12.62 49.05,12.62 | IC2.5 47.87,13.8 49.05,12.62
RGB
  Top 0.406: U1.11 21.54,18.25 19.68,18.25 19.42,17.99 19.42,16.85 18.54,15.96 R9.1
RST  (via drill 0.35)
  Top 0.406: 11.55,28.24 C23.1 9.03,28.52 11.4,28.52 | 11.55,28.24 11.98,28.24 S1.1 11.93,29.04 | 12.39,28.59 U1.3 24.94,28.59 26.16,29.81 v33.27,29.81 | 12.39,28.59 11.9,28.59 11.82,28.52 | 11.82,28.52 11.55,28.24 | 11.4,28.52 11.82,28.52 | 11.93,29.04 11.93,30.4 R6.1 | 11.93,29.04 11.4,28.52 | 11.93,29.04 12.39,28.59
  Bottom 0.406: v33.27,29.81 37.46,29.81 37.59,29.68 T1.C
RTS  (via drill 0.35)
  Top 0.406: v32.63,17.87 32.63,28.41 33.27,29.04 v35.81,29.04
  Bottom 0.406: R8.1 35.05,27.65 35.3,27.65 | 35.3,27.65 35.66,27.65 35.81,27.5 | 35.81,27.5 T1.E | U4.14 33.78,18.38 33.27,17.87 v32.63,17.87 | v35.81,29.04 35.81,28.15 | 35.81,28.15 35.81,27.5 | 35.81,28.15 35.3,27.65
UART0_RX  (via drill 0.35)
  Top 0.406: v35.05,15.84 35.05,24.09 37,26.05 U1.34
  Bottom 0.406: U4.2 v35.05,15.84
UART0_TX  (via drill 0.35)
  Top 0.406: v33.78,15.84 33.78,24.34 36.82,27.39 38.65,27.39 U1.35
  Bottom 0.406: U4.3 v33.78,15.84
USB_D+  (via drill 0.35)
  Top 0.254: J1.A6 30.22,11.01 30.47,11.26 | 30.73,11.26 30.47,11.26 | 30.73,11.26 30.98,11.26 | 30.98,11.26 31.22,11.02 J1.B6 31.24,10.19 v31.24,11.77 | 30.98,11.26 31.24,11.52 v31.24,11.77 | 30.73,11.26 v31.24,11.77 | 30.47,11.26 30.98,11.77 v31.24,11.77
  Bottom 0.254: v31.24,11.77 U4.5
USB_D-  (via drill 0.35)
  Top 0.254: J1.A7 30.73,9.23 30.47,8.98 29.97,8.98 29.72,9.22 J1.B7 29.71,10.19 v29.71,11.77
  Bottom 0.254: v29.71,11.77 29.97,12.03 U4.6
VBAT  (via drill 0.35)
  Top 0.406: R14.2 25.52,24.81 v25.52,23.07 | v50.29,9.1 TP2.TP | Q4.3 42.92,8.05 v42.92,7.07
  Bottom 0.305: 47.24,7.07 VBAT+.1
  Bottom 0.406: C5.1 R13.1 | C5.1 45.67,10.92 45.08,11.52 45.08,13.17 44.12,14.12 U2.5 | v50.29,9.1 48.95,7.77 47.94,7.77 VBAT+.1 | v25.52,23.07 25.52,12.91 26.79,11.64 28.44,11.64 29.38,10.7 29.38,8.22 30.52,7.07 v42.92,7.07 46.6,7.07 | 46.6,7.07 47.24,7.07 | VBAT+.1 46.73,8.34 | 46.73,8.34 46.73,8.6 | 46.73,8.6 46.73,8.85 | 46.73,8.85 C5.1 | 46.73,8.34 46.73,7.2 46.6,7.07 | VBAT+.1 47.62,7.71 46.73,8.6 | VBAT+.1 47.62,7.96 46.73,8.85
VBAT_SENSE
  Top 0.406: U1.4 23.6,27.32 23.7,27.22 R15.2 R14.1
VCC
  Top 0.406: U$2.3 45,7.25 44.61,6.86 C7.1 44.48,4.79 D2.C 40.76,4.79 40.25,5.29 40.25,7.48 Q4.2
VUSB  (via drill 0.35)
  Top 0.305: J1.A4/B9 28.19,10.06 28.19,9.36 29.08,8.47 31.87,8.47 32.87,9.47 J1.B4/A9
  Top 0.406: 38.57,7.32 38.57,7.36 38.47,7.45 R16.2 | J1.B4/A9 32.87,10.87 33.65,11.64 37.71,11.64 | R33.2 23.23,10.88 24,11.64 27.68,11.64 28.07,11.25 J1.A4/B9 | 37.71,11.64 40.51,11.64 41.65,12.79 41.65,20.79 41.9,21.04 v43.43,21.04 | 37.71,11.64 v37.71,10.5 38.44,9.78 38.44,8.81 | R16.2 38.44,8.81 | Q4.1 39.04,9.42 38.44,8.81 | 38.57,7.32 R16.2 | D2.A 38.57,7.32
  Bottom 0.406: LED4.A LED3.A 40.63,9.22 40.63,8.34 40.25,7.96 38.47,7.96 37.71,8.72 v37.71,10.5 37.71,13.17 38.47,13.93 39.43,13.93 U2.8 | v43.43,21.04 U2.4

### Text on the board
tPlace: 3.3v | VBAT
bPlace: SCL | SDA | OUTPUT | GND | 3.3v | 3.3v | GND | SI-SCA HW / ver. 5.0 - 3DPRACTICAL / ©DEC 2022 | BAT+ | BAT-